# Altium project 243-436_MP_Man-ESP32.PrjPcb
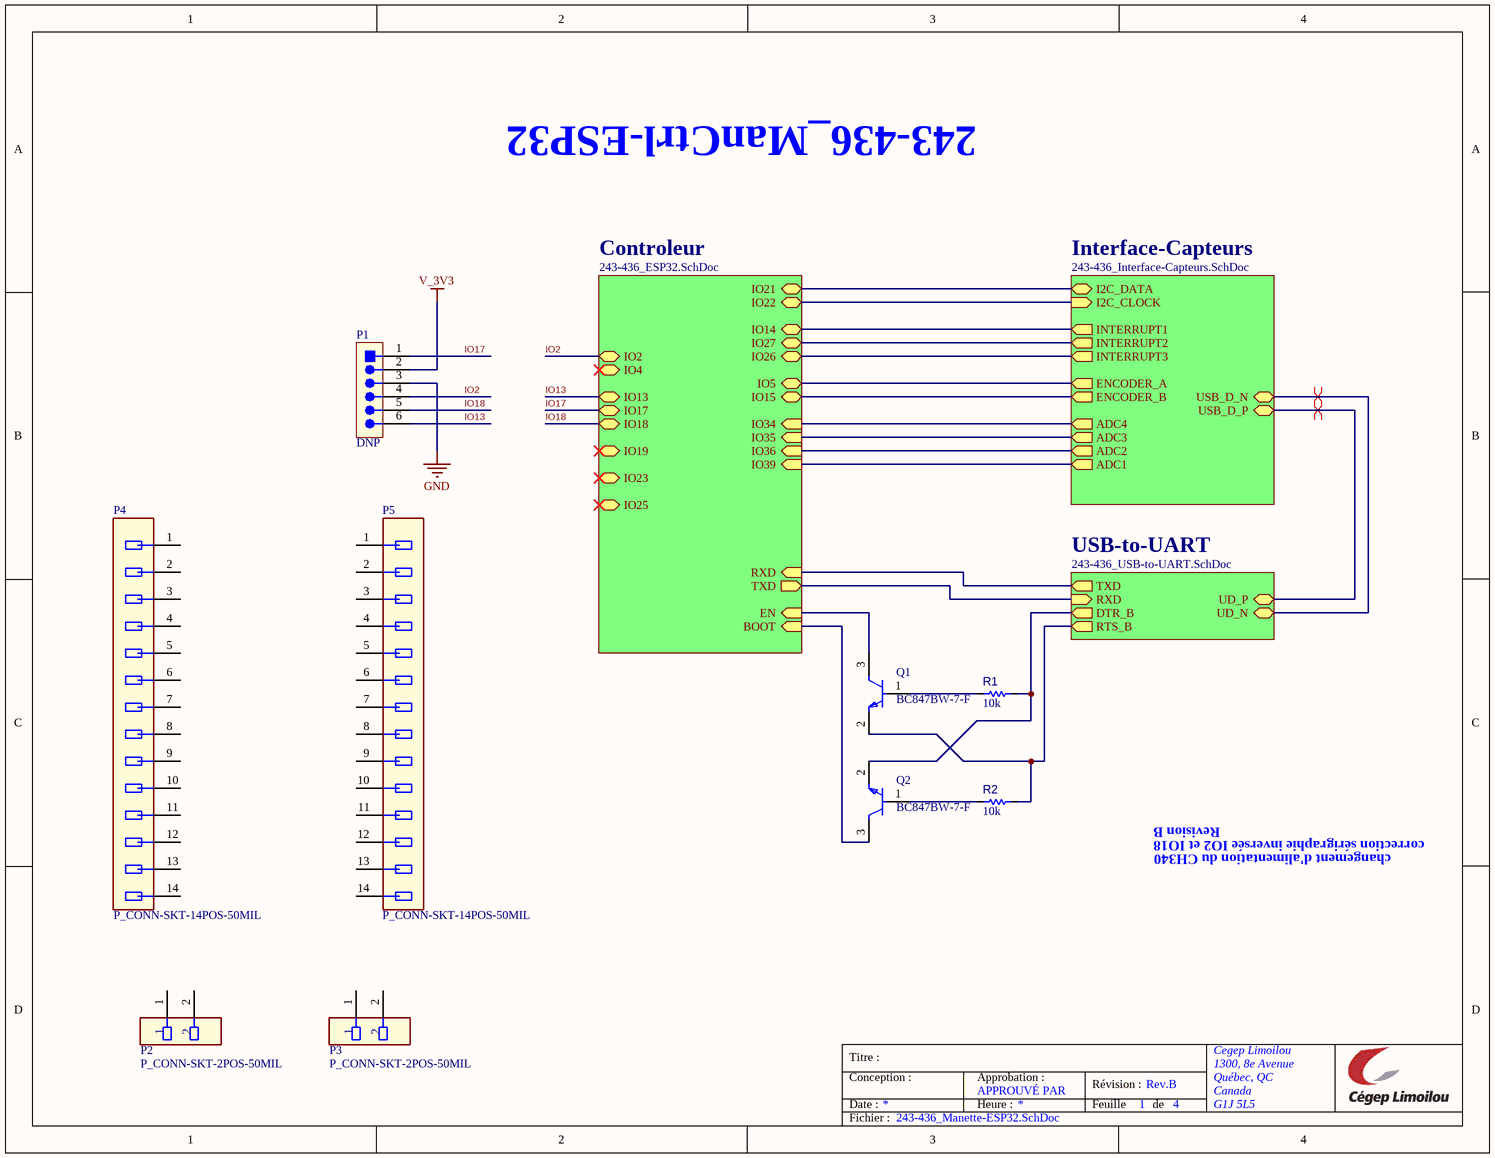
[diagram p0: 243-436_Manette-ESP32.SchDoc]
NomDeLetudiant: Cegep Limoilou; NomDeProjet: 243-436_ManCtrl-ESP32; Revision: Rev.B
4 sheets, 44 parts. Net scope: hierarchical (ports join the sheet entries above them; power ports are global).
Board file: 243-436_Man-Ctrl-ESP32.PcbDoc
Sheets:
  243-436_Manette-ESP32.SchDoc
    Controleur = 243-436_ESP32.SchDoc
    Interface-Capteurs = 243-436_Interface-Capteurs.SchDoc
    USB-to-UART = 243-436_USB-to-UART.SchDoc

## Sheet 243-436_Manette-ESP32.SchDoc: =NomDeProjet
size Letter; ApprovedBy: APPROUVÉ PAR; Author: Cegep Limoilou; Engineer: K.Cotton; Organization: Cegep Limoilou; Address1: 1300, 8e Avenue; Address2: Québec, QC; Address3: Canada; Address4: G1J 5L5; SheetNumber: 1; SheetTotal: 4

### Parts
P1  DNP  [P_CONN_HDR_1ROW_6POS_100MIL]  (no BOM)
P2  P_CONN-SKT-2POS-50MIL  [P_CONN_SKT_1ROW_2POS_50MIL]
P3  P_CONN-SKT-2POS-50MIL  [P_CONN_SKT_1ROW_2POS_50MIL]
P4  P_CONN-SKT-14POS-50MIL  [P_CONN_SKT_1ROW_14POS_50MIL]
P5  P_CONN-SKT-14POS-50MIL  [P_CONN_SKT_1ROW_14POS_50MIL]
Q1  BC847BW-7-F  [SOT323-IPC_B]
Q2  BC847BW-7-F  [SOT323-IPC_B]
R1  value 10k  [R_1005[0402]]  (hidden comment: Res 10k 1% 0402)
R2  value 10k  [R_1005[0402]]  (hidden comment: Res 10k 1% 0402)

### Sub-sheets
Controleur = 243-436_ESP32.SchDoc: IO34 (in), IO35 (in), IO25 (bidir), IO26 (bidir), IO27 (bidir), IO14 (bidir), IO13 (bidir), IO15 (bidir), TXD (out), RXD (in), IO23 (bidir), IO22 (bidir), IO19 (bidir), IO18 (bidir), IO5 (bidir), IO17 (bidir), IO4 (bidir), IO2 (bidir), IO21 (bidir), IO36 (in), IO39 (in), EN (in), BOOT (in)
Interface-Capteurs = 243-436_Interface-Capteurs.SchDoc: USB_D_N (bidir), USB_D_P (bidir), INTERRUPT1 (out), INTERRUPT2 (out), INTERRUPT3 (out), ENCODER_B (out), ENCODER_A (out), I2C_DATA (bidir), I2C_CLOCK (in), ADC4 (out), ADC3 (out), ADC2 (out), ADC1 (out)
USB-to-UART = 243-436_USB-to-UART.SchDoc: RXD (in), TXD (out), UD_P (bidir), UD_N (bidir), RTS_B (out), DTR_B (out)

### Nets
GND: P1.3
V_3V3: P1.2
BOOT: Q2.3(C) ; sheet Controleur/BOOT
DTR_B: Q2.2(E) R1.1 ; sheet USB-to-UART/DTR_B
EN: Q1.3(C) ; sheet Controleur/EN
IO2: P1.4 ; sheet Controleur/IO2
IO5: sheet Controleur/IO5, sheet Interface-Capteurs/ENCODER_A
IO13: P1.6 ; sheet Controleur/IO13
IO14: sheet Controleur/IO14, sheet Interface-Capteurs/INTERRUPT1
IO15: sheet Controleur/IO15, sheet Interface-Capteurs/ENCODER_B
IO17: P1.1 ; sheet Controleur/IO17
IO18: P1.5 ; sheet Controleur/IO18
IO21: sheet Controleur/IO21, sheet Interface-Capteurs/I2C_DATA
IO22: sheet Controleur/IO22, sheet Interface-Capteurs/I2C_CLOCK
IO26: sheet Controleur/IO26, sheet Interface-Capteurs/INTERRUPT3
IO27: sheet Controleur/IO27, sheet Interface-Capteurs/INTERRUPT2
IO34: sheet Controleur/IO34, sheet Interface-Capteurs/ADC4
IO35: sheet Controleur/IO35, sheet Interface-Capteurs/ADC3
IO36: sheet Controleur/IO36, sheet Interface-Capteurs/ADC2
IO39: sheet Controleur/IO39, sheet Interface-Capteurs/ADC1
RTS_B: Q1.2(E) R2.1 ; sheet USB-to-UART/RTS_B
RXD: sheet Controleur/RXD, sheet USB-to-UART/TXD
TXD: sheet Controleur/TXD, sheet USB-to-UART/RXD
UD_N: sheet Interface-Capteurs/USB_D_N, sheet USB-to-UART/UD_N
UD_P: sheet Interface-Capteurs/USB_D_P, sheet USB-to-UART/UD_P
NetQ1_1: Q1.1(B) R1.2
NetQ2_1: Q2.1(B) R2.2

Not connected (* = marked no-connect by the designer): P2 1 2; P3 1 2; P4 1 2 3 4 5 6 7 8 9 10 11 12 13 14; P5 1 2 3 4 5 6 7 8 9 10 11 12 13 14

### Layout directives
differential pair: UD_N, UD_P

### Notes on the sheet
- Revision B
- correction sérigraphie inversée IO2 et IO18
- changement d'alimentation du CH340
- Titre :
- Conception :
- Date :
- Approbation :
- Heure :
- Révision :
- Feuille
- de
- Fichier :

### Library data of the parts
P1 = P_Conn_01x06_100mils: Conn. Header 6pos 100mils; Mounting Technology: Through-hole
P2 P3 = P_CONN-SKT-2POS-50MIL: CONN SOCKET 2POS 1.27mm SINGLE ROW TH; Manufacturer 1: Megastar; Manufacturer Part Number 1: ZX-PM1.27-1-2PU-Z; Mounting Technology: Through-hole; Supplier 1: LCSC; Supplier Part Number 1: C41370629; Manufacturer 2: Sullins
P4 P5 = P_CONN-SKT-14POS-50MIL: CONN SOCKET 14POS 1.27mm SINGLE ROW TH; Manufacturer 1: Megastar; Manufacturer Part Number 1: ZX-PM1.27-1-14PU-Z; Mounting Technology: Through-hole; Supplier 1: LCSC; Supplier Part Number 1: C41370641; Manufacturer 2: Sullins
Q1 Q2 = Q_BC847BW: TRANS NPN 45V 0.1A SC70-3; Manufacturer 1: Diodes Inc; Manufacturer Part Number 1: BC847BW-7-F
R1 R2 = RES003: Resistor type 1; Manufacturer 1: Yageo; Manufacturer Part Number 1: RC0402FR-0710KL; LibRef: RES003; Puissance: 1/16W; Max Working Voltage: 50V; Tolerance: 1%; Mounting Technology: SMT; Supplier 1: LCSC; Supplier Part Number 1: C60490

## Sheet 243-436_ESP32.SchDoc: Contrôleur
size Letter; ApprovedBy: APPROUVÉ PAR; Author: Cegep Limoilou; Engineer: K.Cotton; Organization: Cegep Limoilou; Address1: 1300, 8e Avenue; Address2: Québec, QC; Address3: Canada; Address4: G1J 5L5; SheetNumber: 2; SheetTotal: 4
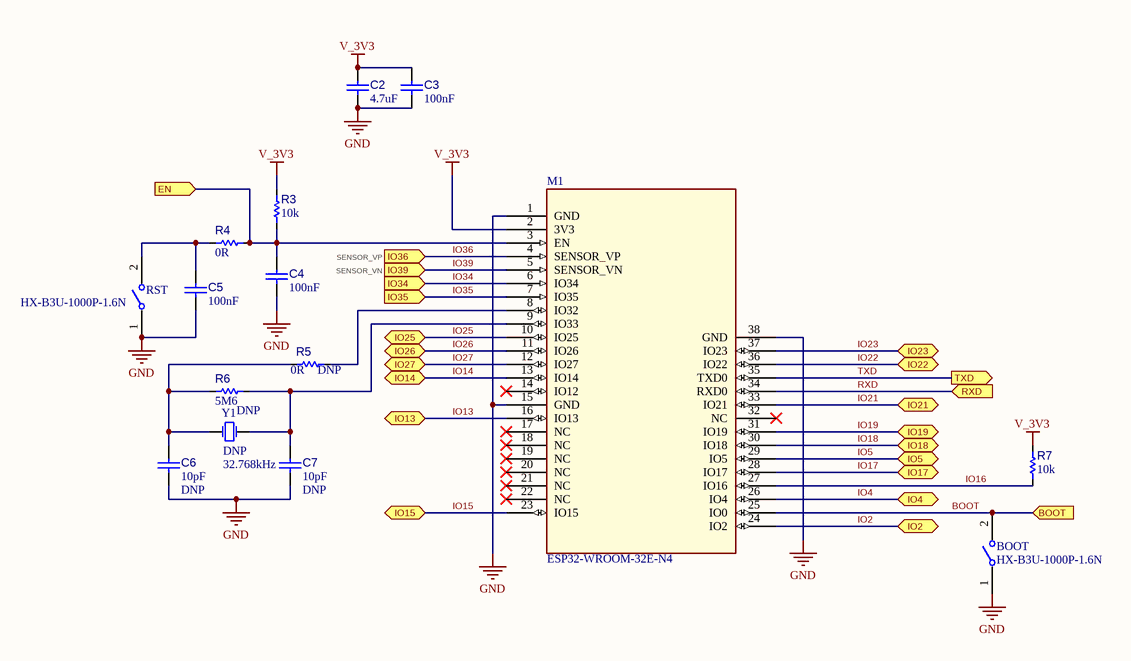
[diagram p1: 243-436_ESP32.SchDoc]

### Parts
BOOT  HX-B3U-1000P-1.6N  [S_B3U-1000P]
C2  value 4.7uF  [C_1005[0402]]  (hidden comment: CAP CER 4.7uF 6.3V X5R 0402)
C3  value 100nF  [C_1005[0402]]  (hidden comment: CAP CER 100nF 50V 0402)
C4  value 100nF  [C_1005[0402]]  (hidden comment: DNP)  (no BOM)
C5  value 100nF  [C_1005[0402]]  (hidden comment: CAP CER 100nF 50V 0402)
C6  DNP  value 10pF  [C_1005[0402]]  (no BOM)
C7  DNP  value 10pF  [C_1005[0402]]  (no BOM)
M1  ESP32-WROOM-32E-N4  [ESP32­WROOM­32E_EXP-TH]
R3  value 10k  [R_1005[0402]]  (hidden comment: DNP)  (no BOM)
R4  value 0R  [R_1005[0402]]  (hidden comment: Res 0R 0402)
R5  DNP  value 0R  [R_1005[0402]]  (no BOM)
R6  DNP  value 5M6  [R_1005[0402]]  (no BOM)
R7  value 10k  [R_1005[0402]]  (hidden comment: Res 10k 1% 0402)
RST  HX-B3U-1000P-1.6N  [S_B3U-1000P]
Y1  DNP  value 32.768kHz  [Y_2012_2P]  (no BOM)

### Ports
BOOT (in, see 243-436_Manette-ESP32[3C]), EN (in, see 243-436_Manette-ESP32[3C]), IO2 (bidir, see 243-436_Manette-ESP32[2B]), IO4 (bidir, see 243-436_Manette-ESP32[2B]), IO5 (bidir, see 243-436_Manette-ESP32[3B]), IO13 (bidir, see 243-436_Manette-ESP32[2B]), IO14 (bidir, see 243-436_Manette-ESP32[3B]), IO15 (bidir, see 243-436_Manette-ESP32[3B]), IO17 (bidir, see 243-436_Manette-ESP32[2B]), IO18 (bidir, see 243-436_Manette-ESP32[2B]), IO19 (bidir, see 243-436_Manette-ESP32[2B]), IO21 (bidir, see 243-436_Manette-ESP32[3A]), IO22 (bidir, see 243-436_Manette-ESP32[3B]), IO23 (bidir, see 243-436_Manette-ESP32[2B]), IO25 (bidir, see 243-436_Manette-ESP32[2B]), IO26 (bidir, see 243-436_Manette-ESP32[3B]), IO27 (bidir, see 243-436_Manette-ESP32[3B]), IO34 (in, see 243-436_Manette-ESP32[3B]), IO35 (in, see 243-436_Manette-ESP32[3B]), IO36 (in, see 243-436_Manette-ESP32[3B]), IO39 (in, see 243-436_Manette-ESP32[3B]), RXD (in, see 243-436_Manette-ESP32[3B]), TXD (out, see 243-436_Manette-ESP32[3C])

### Nets
GND: BOOT.1 C2.1 C3.1 C4.1 C5.1 C6.1 C7.1 M1.1(GND) M1.15(GND) M1.38(GND) RST.1
V_3V3: C2.2 C3.2 M1.2(3V3) R3.2 R7.2
BOOT: BOOT.2 M1.25(IO0) ; port BOOT
EN: C4.2 M1.3(EN) R3.1 R4.2 ; port EN
IO2: M1.24(IO2) ; port IO2
IO4: M1.26(IO4) ; port IO4
IO5: M1.29(IO5) ; port IO5
IO13: M1.16(IO13) ; port IO13
IO14: M1.13(IO14) ; port IO14
IO15: M1.23(IO15) ; port IO15
IO16: M1.27(IO16) R7.1
IO17: M1.28(IO17) ; port IO17
IO18: M1.30(IO18) ; port IO18
IO19: M1.31(IO19) ; port IO19
IO21: M1.33(IO21) ; port IO21
IO22: M1.36(IO22) ; port IO22
IO23: M1.37(IO23) ; port IO23
IO25: M1.10(IO25) ; port IO25
IO26: M1.11(IO26) ; port IO26
IO27: M1.12(IO27) ; port IO27
IO34: M1.6(IO34) ; port IO34
IO35: M1.7(IO35) ; port IO35
IO36: M1.4(SENSOR_VP) ; port IO36
IO39: M1.5(SENSOR_VN) ; port IO39
RXD: M1.34(RXD0) ; port RXD
TXD: M1.35(TXD0) ; port TXD
NetC5_2: C5.2 R4.1 RST.2
NetC6_2: C6.2 R5.1 R6.1 Y1.1(OSC1)
NetC7_2: C7.2 M1.9(IO33) R6.2 Y1.2(OSC2)
NetM1_8: M1.8(IO32) R5.2

Not connected (* = marked no-connect by the designer): M1 14(IO12)* 17(NC)* 18(NC)* 19(NC)* 20(NC)* 21(NC)* 22(NC)* 32(NC)*

### Notes on the sheet
- SENSOR_VP
- SENSOR_VN
- Titre :
- Conception :
- Date :
- Approbation :
- Heure :
- Révision :
- Feuille
- de
- Fichier :

### Library data of the parts
BOOT RST = SW_B3U-1000P: SWITCH TACTILE SPST-NO 0.05A 12V; Manufacturer 1: hanxia; Mounting Technology: SMT; Supplier 1: LCSC; Supplier Part Number 1: C49234121; Manufacturer 2: Omron; Manufacturer Part Number 1: HX-B3U-1000P-1.6N; Manufacturer Part Number 2: B3U-1000P
C2 = CAP016: Capacitor type 1; Manufacturer 1: Samsung; Manufacturer Part Number 1: CL05A475MQ5NRNC; LibRef: CAP016; Tolerance: 20%; Rated Voltage: 6.3V; Dielectric: X5R; Mounting Technology: SMT; Supplier 1: LCSC; Supplier Part Number 1: C307423
C3 C5 = CAP001: Capacitor type 1; Manufacturer 1: Yageo; Manufacturer Part Number 1: CC0402KRX7R9BB104; LibRef: CAP001; Tolerance: 10%; Dielectric: X7R; Code CEGEP: KCOND01SM; Rated Voltage: 50V; Mounting Technology: SMT; Supplier 1: LCSC; Supplier Part Number 1: C131394
C4 = CAP001: Capacitor type 1; Manufacturer 1: Yageo; Manufacturer Part Number 1: CC0402KRX7R9BB104; LibRef: CAP001; Tolerance: 10%; Rated Voltage: 50V; Dielectric: X7R; Code CEGEP: KCOND01SM; Mounting Technology: SMT; Supplier 1: LCSC; Supplier Part Number 1: C131394
C6 C7 = CAP014: Capacitor type 1; Manufacturer 1: Yageo; Manufacturer Part Number 1: CC0402JRNPO9BN100; LibRef: CAP014; Tolerance: 5%; Rated Voltage: 50V; Dielectric: C0G; Mounting Technology: SMT; Supplier 1: LCSC; Supplier Part Number 1: C106199
M1 = M_ESP32-WROOM-32E-N4-TH: ESP32 Module SMT Castellated; Manufacturer 1: Espressif Systems; Manufacturer Part Number 1: ESP32-WROOM-32E-N4; Mounting Technology: TH; Supplier 1: LCSC; Supplier Part Number 1: C701341
R3 = RES003: Resistor type 1; Manufacturer 1: Yageo; Manufacturer Part Number 1: RC0402FR-0710KL; LibRef: RES003; Tolerance: 1%; Puissance: 1/16W; Max Working Voltage: 50V; Mounting Technology: SMT; Supplier 1: LCSC; Supplier Part Number 1: C60490
R4 R5 = RES005: Resistor type 1; Manufacturer 1: Yageo; Manufacturer Part Number 1: RC0402JR-070RL; LibRef: RES005; Max Working Voltage: 50V; Code CEGEP: RES0SM; Mounting Technology: SMT; Supplier 1: LCSC; Supplier Part Number 1: C60485
R6 = RES017: Resistor type 1; Manufacturer 1: Yageo; Manufacturer Part Number 1: RC0402FR-075M6L; LibRef: RES017; Tolerance: 1%; Puissance: 1/16W; Max Working Voltage: 50V; Mounting Technology: SMT; Supplier 1: LCSC; Supplier Part Number 1: C477755
R7 = RES003: as R1 on sheet 243-436_Manette-ESP32; Tolerance: 1%; Mounting Technology: SMT; Supplier 1: LCSC; Supplier Part Number 1: C60490
Y1 = Y_NX2012_32K768: Crystal NDK 2.0x1.2mm  32.768 KHz; Manufacturer Part Number 1: NX2012SA 32.768KHz  EXS00A-MU00389; Manufacturer 1: NDK; Manufacturer 2: Epson; Manufacturer Part Number 2: X1A0000610008; Supplier Part Number 1: C96341; Supplier 1: LCSC; Mounting Technology: SMT

## Sheet 243-436_Interface-Capteurs.SchDoc: Interface Capteurs
size Letter; ApprovedBy: APPROUVÉ PAR; Author: Cegep Limoilou; Engineer: K.Cotton; Organization: Cegep Limoilou; Address1: 1300, 8e Avenue; Address2: Québec, QC; Address3: Canada; Address4: G1J 5L5; SheetNumber: 3; SheetTotal: 4
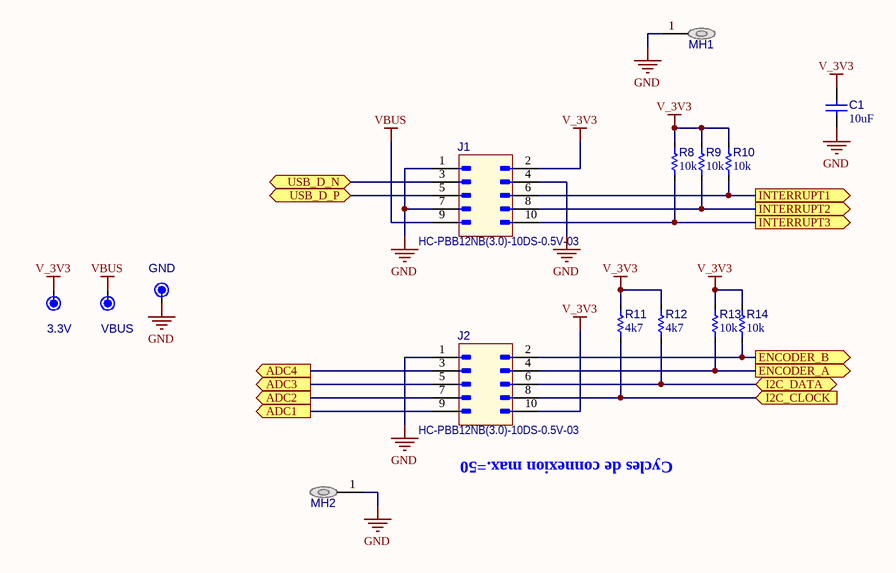
[diagram p2: 243-436_Interface-Capteurs.SchDoc]

### Parts
3.3V  DNP  [TP_TH061]  (value not drawn)  (no BOM)
C1  value 10uF  [C_2012[0805]]  (hidden comment: CAP CER 10uF 25V X5R 0805)
GND  DNP  [TP_TH061]  (value not drawn)  (no BOM)
J1  HC-PBB12NB(3.0)-10DS-0.5V-03  [J_CONN_HDR_2ROW_10POS_0MM5]
J2  HC-PBB12NB(3.0)-10DS-0.5V-03  [J_CONN_HDR_2ROW_10POS_0MM5]
MH1  MP_1.6MM  [MP_M-Hole_M1.6]  (value not drawn)  (no BOM)
MH2  MP_1.6MM  [MP_M-Hole_M1.6]  (value not drawn)  (no BOM)
R8  value 10k  [R_1005[0402]]  (hidden comment: Res 10k 1% 0402)
R9  value 10k  [R_1005[0402]]  (hidden comment: Res 10k 1% 0402)
R10  value 10k  [R_1005[0402]]  (hidden comment: Res 10k 1% 0402)
R11  value 4k7  [R_1005[0402]]  (hidden comment: Res 4k7 1% 0402)
R12  value 4k7  [R_1005[0402]]  (hidden comment: Res 4k7 1% 0402)
R13  value 10k  [R_1005[0402]]  (hidden comment: Res 10k 1% 0402)
R14  value 10k  [R_1005[0402]]  (hidden comment: Res 10k 1% 0402)
VBUS  DNP  [TP_TH061]  (value not drawn)  (no BOM)

### Ports
ADC1 (out, see 243-436_Manette-ESP32[3B]), ADC2 (out, see 243-436_Manette-ESP32[3B]), ADC3 (out, see 243-436_Manette-ESP32[3B]), ADC4 (out, see 243-436_Manette-ESP32[3B]), ENCODER_A (out, see 243-436_Manette-ESP32[3B]), ENCODER_B (out, see 243-436_Manette-ESP32[3B]), I2C_CLOCK (in, see 243-436_Manette-ESP32[3B]), I2C_DATA (bidir, see 243-436_Manette-ESP32[3A]), INTERRUPT1 (out, see 243-436_Manette-ESP32[3B]), INTERRUPT2 (out, see 243-436_Manette-ESP32[3B]), INTERRUPT3 (out, see 243-436_Manette-ESP32[3B]), USB_D_N (bidir, see 243-436_Manette-ESP32[4B]), USB_D_P (bidir, see 243-436_Manette-ESP32[4B])

### Nets
GND: C1.1 GND.1 J1.1 J1.4 J1.7 J2.1 MH1.1 MH2.1
V_3V3: 3.3V.1 C1.2 J1.2 J2.10 R8.2 R9.2 R10.2 R11.2 R12.2 R13.2 R14.2
VBUS: J1.9 VBUS.1
IO5: J2.4 R13.1 ; port ENCODER_A
IO14: J1.6 R10.1 ; port INTERRUPT1
IO15: J2.2 R14.1 ; port ENCODER_B
IO21: J2.6 R12.1 ; port I2C_DATA
IO22: J2.8 R11.1 ; port I2C_CLOCK
IO26: J1.10 R8.1 ; port INTERRUPT3
IO27: J1.8 R9.1 ; port INTERRUPT2
IO34: J2.3 ; port ADC4
IO35: J2.5 ; port ADC3
IO36: J2.7 ; port ADC2
IO39: J2.9 ; port ADC1
UD_N: J1.3 ; port USB_D_N
UD_P: J1.5 ; port USB_D_P

### Notes on the sheet
- (near J2) Cycles de connexion max.=50
- Titre :
- Conception :
- Date :
- Approbation :
- Heure :
- Révision :
- Feuille
- de
- Fichier :

### Library data of the parts
3.3V GND VBUS = TP_TH0.61mm(AWG28): Pad TH 0.61mm diameter (AWG28); Value: DNP; Manufacturer Part Number 1: DNP; Supplier Part Number 1: N/A; Supplier 1: N/A
C1 = CAP020: Capacitor type 1; Manufacturer 1: Samsung; Manufacturer Part Number 1: CL21A106KAYNNNE; LibRef: CAP020; Tolerance: 10%; Rated Voltage: 25V; Dielectric: X5R; Mounting Technology: SMT; Supplier 1: LCSC; Supplier Part Number 1: C15850
J1 J2 = J_Conn_02x05: Connector Receptacle 2x5pos, 0,5mm; Manufacturer 1: Hirose; Manufacturer Part Number 1: DF12NB(3.0)-10DS-0.5V(51); Code CEGEP: KPTSO011; Manufacturer 2: HCTL; Manufacturer Part Number 2: HC-PBB12NB(3.0)-10DS-0.5V-03; Mounting Technology: SMT; Value: Conn_02x05; Supplier 1: LCSC; Supplier 2: Digikey; Supplier Part Number 1: C2904118; Supplier Part Number 2: 26-DF12NB(3.0)-10DS-0.5V(51)CT-ND
MH1 MH2 = MP_1.6MM: Mounting Hole 1.6mm; Mounting Technology: Through-hole
R8-R10 R13 R14 = RES003: as R1 on sheet 243-436_Manette-ESP32; Tolerance: 1%; Mounting Technology: SMT; Supplier 1: LCSC; Supplier Part Number 1: C60490
R11 R12 = RES007: Resistor type 1; Manufacturer 1: Yageo; Manufacturer Part Number 1: RC0402FR-074K7L; LibRef: RES007; Puissance: 1/16W; Max Working Voltage: 50V; Code CEGEP: RES4.7KSM; Tolerance: 1%; Mounting Technology: SMT; Supplier 1: LCSC; Supplier Part Number 1: C105871

## Sheet 243-436_USB-to-UART.SchDoc: USB à UART
size Letter; ApprovedBy: APPROUVÉ PAR; Author: Cegep Limoilou; Engineer: K.Cotton; Organization: Cegep Limoilou; Address1: 1300, 8e Avenue; Address2: Québec, QC; Address3: Canada; Address4: G1J 5L5; SheetNumber: 4; SheetTotal: 4
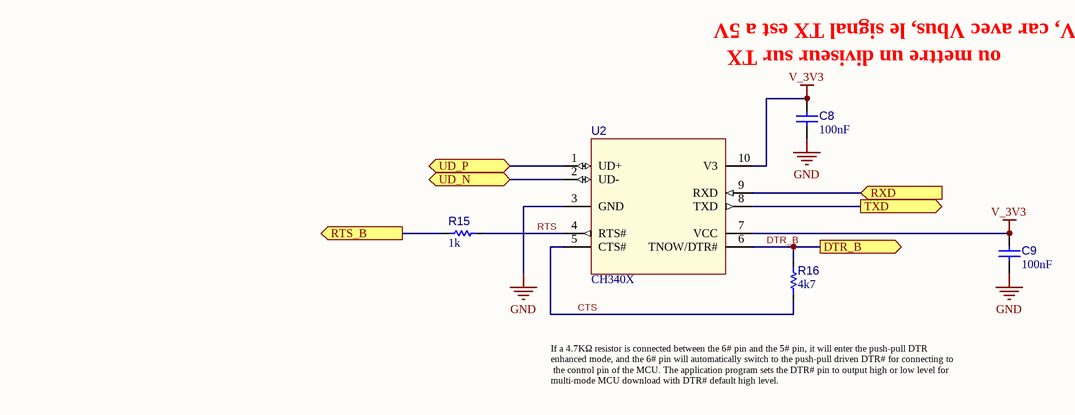
[diagram p3: 243-436_USB-to-UART.SchDoc]

### Parts
C8  value 100nF  [C_1005[0402]]  (hidden comment: CAP CER 100nF 50V 0402)
C9  value 100nF  [C_1005[0402]]  (hidden comment: CAP CER 100nF 50V 0402)
R15  value 1k  [R_1005[0402]]  (hidden comment: Res 1k 1% 0402)
R16  value 4k7  [R_1005[0402]]  (hidden comment: Res 4k7 1% 0402)
U2  CH340X  [U_MSOP50P300X500-10(RM-10)_WO-TP]

### Ports
DTR_B (out, see 243-436_Manette-ESP32[3C]), RTS_B (out, see 243-436_Manette-ESP32[3C]), RXD (in, see 243-436_Manette-ESP32[3C]), TXD (out, see 243-436_Manette-ESP32[3C]), UD_N (bidir, see 243-436_Manette-ESP32[4C]), UD_P (bidir, see 243-436_Manette-ESP32[4C])

### Nets
GND: C8.1 C9.1 U2.3(GND)
V_3V3: C8.2 C9.2 U2.7(VCC) U2.10(V3)
CTS: R16.1 U2.5(CTS#)
DTR_B: R16.2 U2.6(TNOW/DTR#) ; port DTR_B
RTS: R15.2 U2.4(RTS#)
RTS_B: R15.1 ; port RTS_B
RXD: U2.8(TXD) ; port TXD
TXD: U2.9(RXD) ; port RXD
UD_N: U2.2(UD-) ; port UD_N
UD_P: U2.1(UD+) ; port UD_P

### Notes on the sheet
- passer en mode 3.3V, car avec Vbus, le signal TX est a 5V
- (near C8) ou mettre un diviseur sur TX
- (near R16) If a 4.7KΩ resistor is connected between the 6# pin and the 5# pin, it will enter the push-pull DTR
  enhanced mode, and the 6# pin will automatically switch to the push-pull driven DTR# for connecting to
  the control pin of the MCU. The application program sets the DTR# pin to output high or low level for
  multi-mode MCU download with DTR# default high level.
- Titre :
- Conception :
- Date :
- Approbation :
- Heure :
- Révision :
- Feuille
- de
- Fichier :

### Library data of the parts
C8 C9 = CAP001: as C3 on sheet 243-436_ESP32; Rated Voltage: 50V; Mounting Technology: SMT; Supplier 1: LCSC; Supplier Part Number 1: C131394
R15 = RES006: Resistor type 1; Manufacturer 1: Yageo; Manufacturer Part Number 1: RC0402FR-071kL; LibRef: RES006; Puissance: 1/16W; Max Working Voltage: 50V; Code CEGEP: RES1KSM; Tolerance: 1%; Mounting Technology: SMT; Supplier 1: LCSC; Supplier Part Number 1: C106235
R16 = RES007: as R11 on sheet 243-436_Interface-Capteurs; Tolerance: 1%; Mounting Technology: SMT; Supplier 1: LCSC; Supplier Part Number 1: C105871
U2 = U_CH340X: IC USB to Serial Port; Manufacturer 1: WCH(Jiangsu Qin Heng); Manufacturer Part Number 1: CH340X; Mounting Technology: SMT; Supplier 1: LCSC; Supplier Part Number 1: C3035748

## Nets that join several sheets
GND: 243-436_Manette-ESP32 (P1.3), 243-436_ESP32 (11 pins), 243-436_Interface-Capteurs (8 pins), 243-436_USB-to-UART (C8.1 C9.1 U2.3)
V_3V3: 243-436_Manette-ESP32 (P1.2), 243-436_ESP32 (5 pins), 243-436_Interface-Capteurs (11 pins), 243-436_USB-to-UART (C8.2 C9.2 U2.7 U2.10)
BOOT: 243-436_Manette-ESP32 (Q2.3), 243-436_ESP32 (BOOT.2 M1.25)
DTR_B: 243-436_Manette-ESP32 (Q2.2 R1.1), 243-436_USB-to-UART (R16.2 U2.6)
EN: 243-436_Manette-ESP32 (Q1.3), 243-436_ESP32 (C4.2 M1.3 R3.1 R4.2)
IO2: 243-436_Manette-ESP32 (P1.4), 243-436_ESP32 (M1.24)
IO5: 243-436_ESP32 (M1.29), 243-436_Interface-Capteurs (J2.4 R13.1)
IO13: 243-436_Manette-ESP32 (P1.6), 243-436_ESP32 (M1.16)
IO14: 243-436_ESP32 (M1.13), 243-436_Interface-Capteurs (J1.6 R10.1)
IO15: 243-436_ESP32 (M1.23), 243-436_Interface-Capteurs (J2.2 R14.1)
IO17: 243-436_Manette-ESP32 (P1.1), 243-436_ESP32 (M1.28)
IO18: 243-436_Manette-ESP32 (P1.5), 243-436_ESP32 (M1.30)
IO21: 243-436_ESP32 (M1.33), 243-436_Interface-Capteurs (J2.6 R12.1)
IO22: 243-436_ESP32 (M1.36), 243-436_Interface-Capteurs (J2.8 R11.1)
IO26: 243-436_ESP32 (M1.11), 243-436_Interface-Capteurs (J1.10 R8.1)
IO27: 243-436_ESP32 (M1.12), 243-436_Interface-Capteurs (J1.8 R9.1)
IO34: 243-436_ESP32 (M1.6), 243-436_Interface-Capteurs (J2.3)
IO35: 243-436_ESP32 (M1.7), 243-436_Interface-Capteurs (J2.5)
IO36: 243-436_ESP32 (M1.4), 243-436_Interface-Capteurs (J2.7)
IO39: 243-436_ESP32 (M1.5), 243-436_Interface-Capteurs (J2.9)
RTS_B: 243-436_Manette-ESP32 (Q1.2 R2.1), 243-436_USB-to-UART (R15.1)
RXD: 243-436_ESP32 (M1.34), 243-436_USB-to-UART (U2.8)
TXD: 243-436_ESP32 (M1.35), 243-436_USB-to-UART (U2.9)
UD_N: 243-436_Interface-Capteurs (J1.3), 243-436_USB-to-UART (U2.2)
UD_P: 243-436_Interface-Capteurs (J1.5), 243-436_USB-to-UART (U2.1)